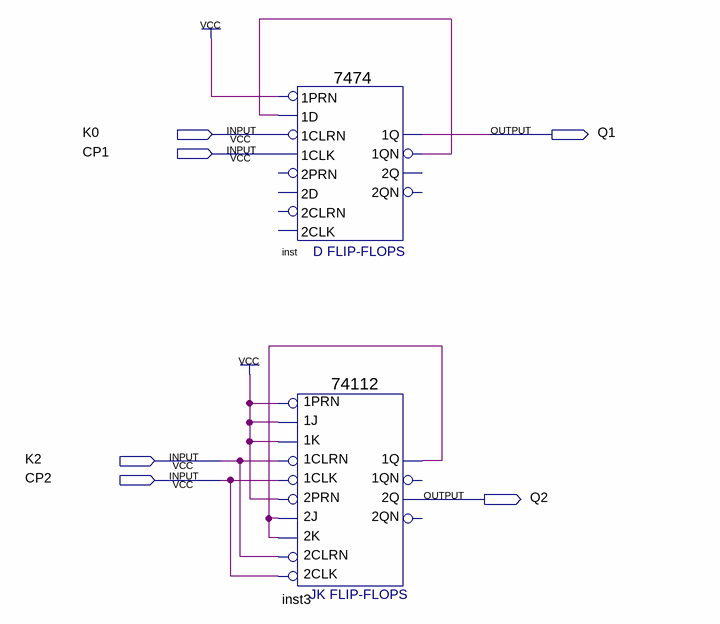
[diagram p0: schematic sheet]
// Quartus schematic pj605.bdf as structural Verilog: 2 symbols, 6 pins
module pj605 (
  input  K0,
  input  CP1,
  input  K2,
  input  CP2,
  output Q1,
  output Q2
);

  wire inst3_1q, inst_1qn;

  \7474  inst (
    .\1CLK (CP1), .\1D (inst_1qn), .\1PRN (1'b1), .\1CLRN (K0), .\1QN (inst_1qn), .\1Q (Q1));  // open: 2D, 2PRN, 2CLK, 2CLRN, 2Q, 2QN
  \74112  inst3 (
    .\1K (1'b1), .\1J (1'b1), .\1PRN (1'b1), .\1CLK (CP2), .\1CLRN (K2), .\2K (inst3_1q), .\2J (inst3_1q),
    .\2PRN (1'b1), .\2CLK (CP2), .\2CLRN (K2), .\2Q (Q2), .\1Q (inst3_1q));  // open: 1QN, 2QN
endmodule
